# EAGLE design LIC_rack_TS_ext-00 (EAGLE 7.2.0)
AUTHOR: M. Petrilak; VERSION: 00
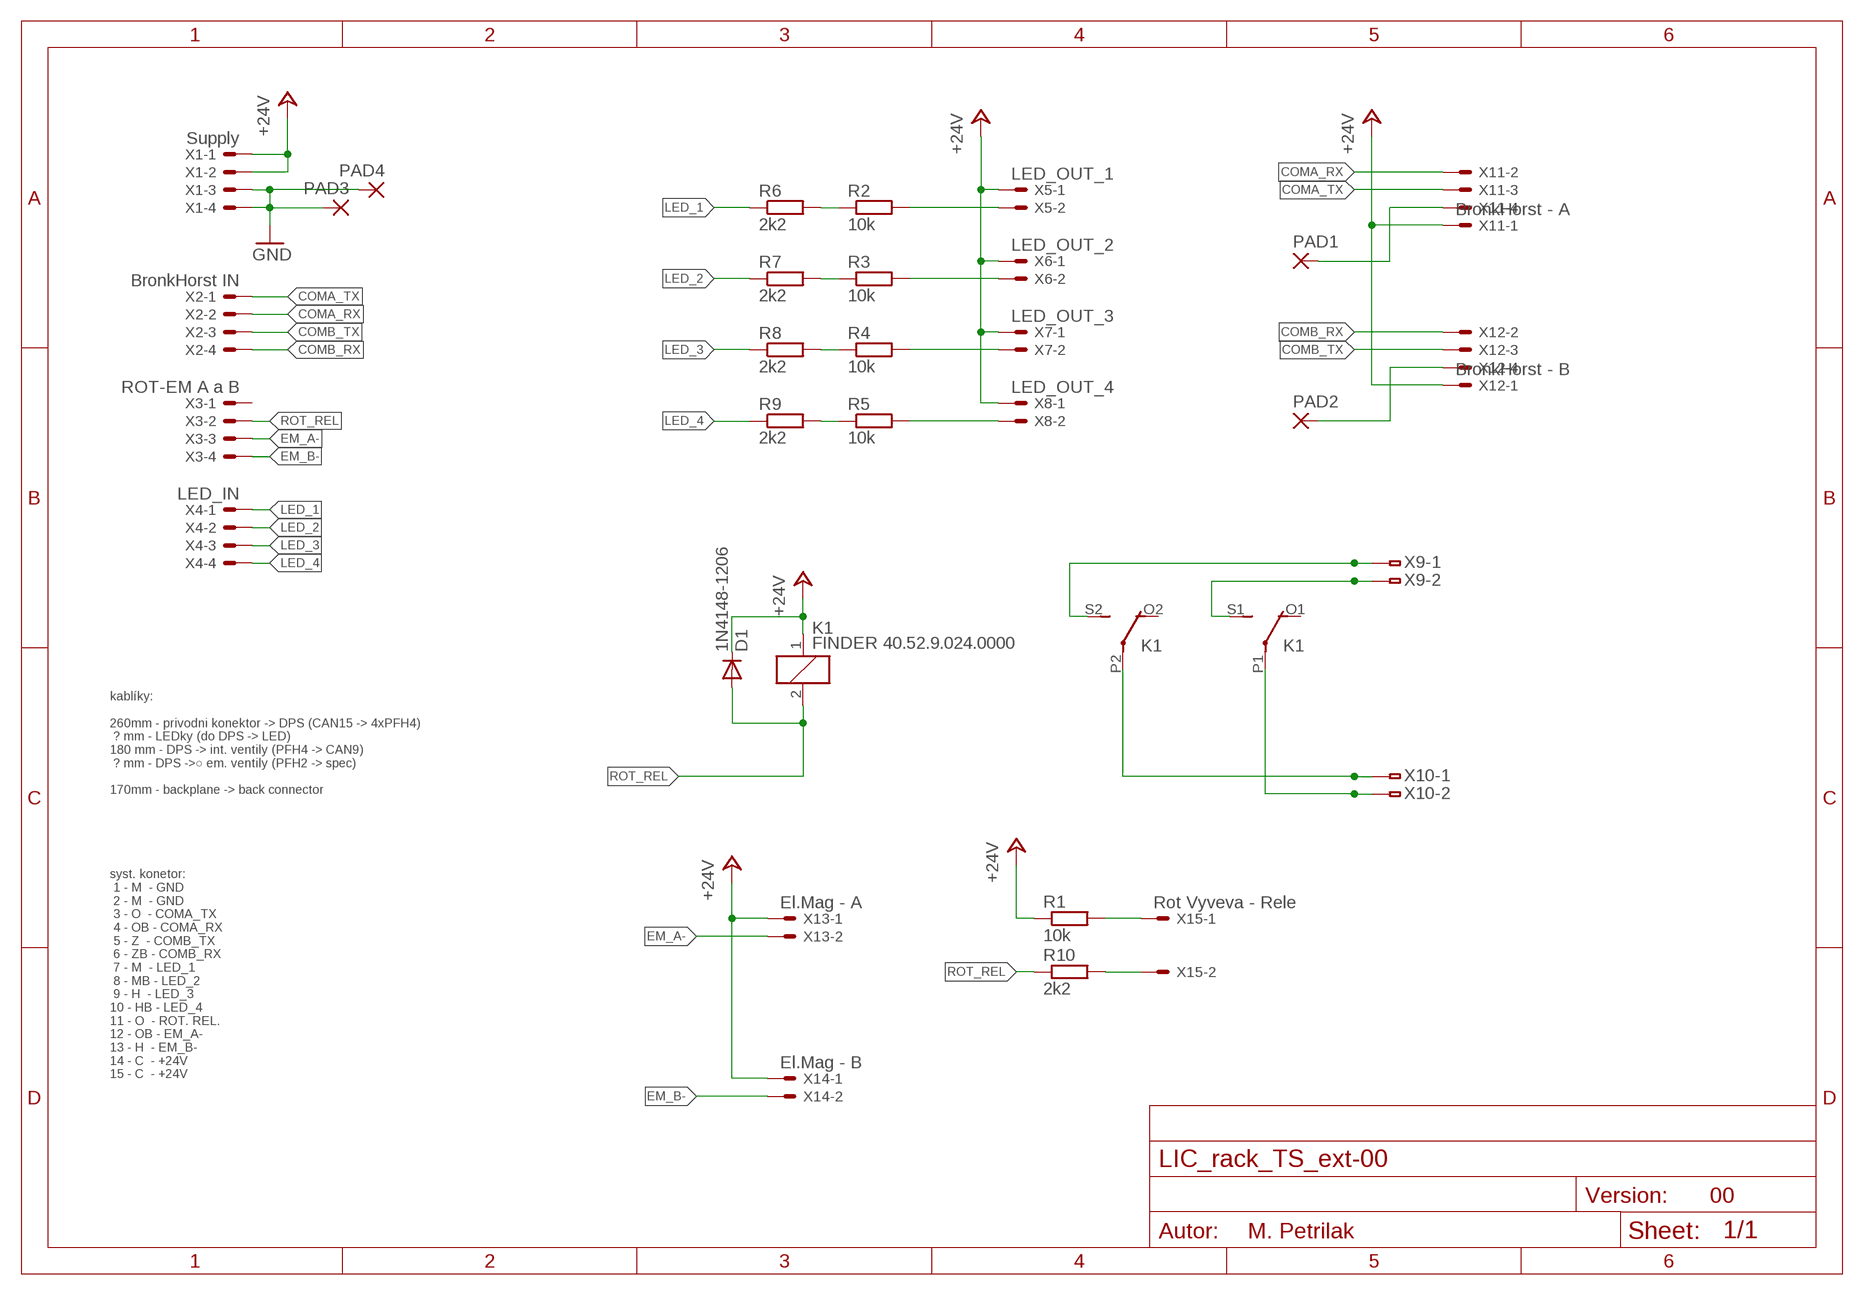
[diagram p0: schematic, sheet 1]

## Parts
D1  1N4148-1206  [R1206]
K1  FINDER 40.52.9.024.0000  4052  [F4052]
PAD1  SMD-2X3  [SMD2-3]
PAD2  SMD-2X3  [SMD2-3]
PAD3  SMD-2X3  [SMD2-3]
PAD4  SMD-2X3  [SMD2-3]
R1  10k  R-EU_R1206  [R1206]
R2  10k  R-EU_R1206  [R1206]
R3  10k  R-EU_R1206  [R1206]
R4  10k  R-EU_R1206  [R1206]
R5  10k  R-EU_R1206  [R1206]
R6  2k2  R-EU_R1206  [R1206]
R7  2k2  R-EU_R1206  [R1206]
R8  2k2  R-EU_R1206  [R1206]
R9  2k2  R-EU_R1206  [R1206]
R10  2k2  R-EU_R1206  [R1206]
X1  Supply  22-23-2041  [22-23-2041]
X2  BronkHorst IN  22-23-2041  [22-23-2041]
X3  ROT-EM A a B  22-23-2041  [22-23-2041]
X4  LED_IN  22-23-2041  [22-23-2041]
X5  LED_OUT_1  22-23-2021  [22-23-2021]
X6  LED_OUT_2  22-23-2021  [22-23-2021]
X7  LED_OUT_3  22-23-2021  [22-23-2021]
X8  LED_OUT_4  22-23-2021  [22-23-2021]
X9  High Voltage Supply - L  WAGO236-401/2  [WAGO236-401_2]
X10  High Voltage Supply - N  WAGO236-401/2  [WAGO236-401_2]
X11  BronkHorst - A  22-23-2041  [22-23-2041]
X12  BronkHorst - B  22-23-2041  [22-23-2041]
X13  El.Mag - A  22-23-2021  [22-23-2021]
X14  El.Mag - B  22-23-2021  [22-23-2021]
X15  Rot Vyveva - Rele  22-23-2021  [22-23-2021]

## Nets
+24V: D1.K(C) K1.1 R1.1 X1.1 X1.2 X5.1 X6.1 X7.1 X8.1 X11.1 X12.1 X13.1 X14.1
COMA_RX: X2.2 X11.2
COMA_TX: X2.1 X11.3
COMB_RX: X2.4 X12.2
COMB_TX: X2.3 X12.3
EM_A-: X3.3 X13.2
EM_B-: X3.4 X14.2
GND: PAD3.1(P) PAD4.1(P) X1.3 X1.4
LED_1: R6.1 X4.1
LED_2: R7.1 X4.2
LED_3: R8.1 X4.3
LED_4: R9.1 X4.4
N$3 [230V]: K1.S1(2:S) X9.2A X9.2B
N$4 [230V]: K1.S2(3:S) X9.1A X9.1B
N$5 [230V]: K1.P1(2:P) X10.2A X10.2B
N$6 [230V]: K1.P2(3:P) X10.1A X10.1B
N$7: R2.2 X5.2
N$8: R3.2 X6.2
N$11: R4.2 X7.2
N$13: R5.2 X8.2
N$14: R2.1 R6.2
N$15: R3.1 R7.2
N$16: R4.1 R8.2
N$17: R5.1 R9.2
N$18: PAD1.1(P) X11.4
N$19: PAD2.1(P) X12.4
N$20: R10.2 X15.2
N$21: R1.2 X15.1
ROT_REL: D1.A K1.2 R10.1 X3.2
Unconnected: K1.O1(2:O) K1.O2(3:O) X3.1

## Notes on the sheet
- kablíky:
  
  260mm - privodni konektor -> DPS (CAN15 -> 4xPFH4)
   ? mm - LEDky (do DPS -> LED) 
  180 mm - DPS -> int. ventily (PFH4 -> CAN9)
   ? mm - DPS ->○ em. ventily (PFH2 -> spec)
  
  170mm - backplane -> back connector
- syst. konetor:
   1 - M  - GND
   2 - M  - GND
   3 - O  - COMA_TX
   4 - OB - COMA_RX
   5 - Z  - COMB_TX
   6 - ZB - COMB_RX
   7 - M  - LED_1
   8 - MB - LED_2
   9 - H  - LED_3
  10 - HB - LED_4
  11 - O  - ROT. REL.
  12 - OB - EM_A-
  13 - H  - EM_B-
  14 - C  - +24V
  15 - C  - +24V

## Library data of the parts
D1 = diode:1N4148: DIODE high speed (Philips)
K1 = relay:4052: RELAY 2 x switch, Finder
PAD1-PAD4 = wirepad:SMD: SMD PAD
R1-R10 = rcl:R-EU_: RESISTOR, European symbol
X1-X4 X11 X12 = con-molex:22-23-2041: .100" (2.54mm) Center Header - 4 Pin
X5-X8 X13-X15 = con-molex:22-23-2021: .100" (2.54mm) Center Header - 2 Pin
X9 X10 = con-malina:WAGO236-401/2: WAGO236-401 Modular Terminal Blocks 0.08-2.5 mm2 Pin Spacing 5 mm Rating: 500V, 16A Color item no. grey 236-401 dark grey 236-742 light grey 236-743 blue 236-744 green 236-745 orange 236-746 light green 236-747 black 236-851

## Net classes
1 230V: clearance 2.7 mm

## Board
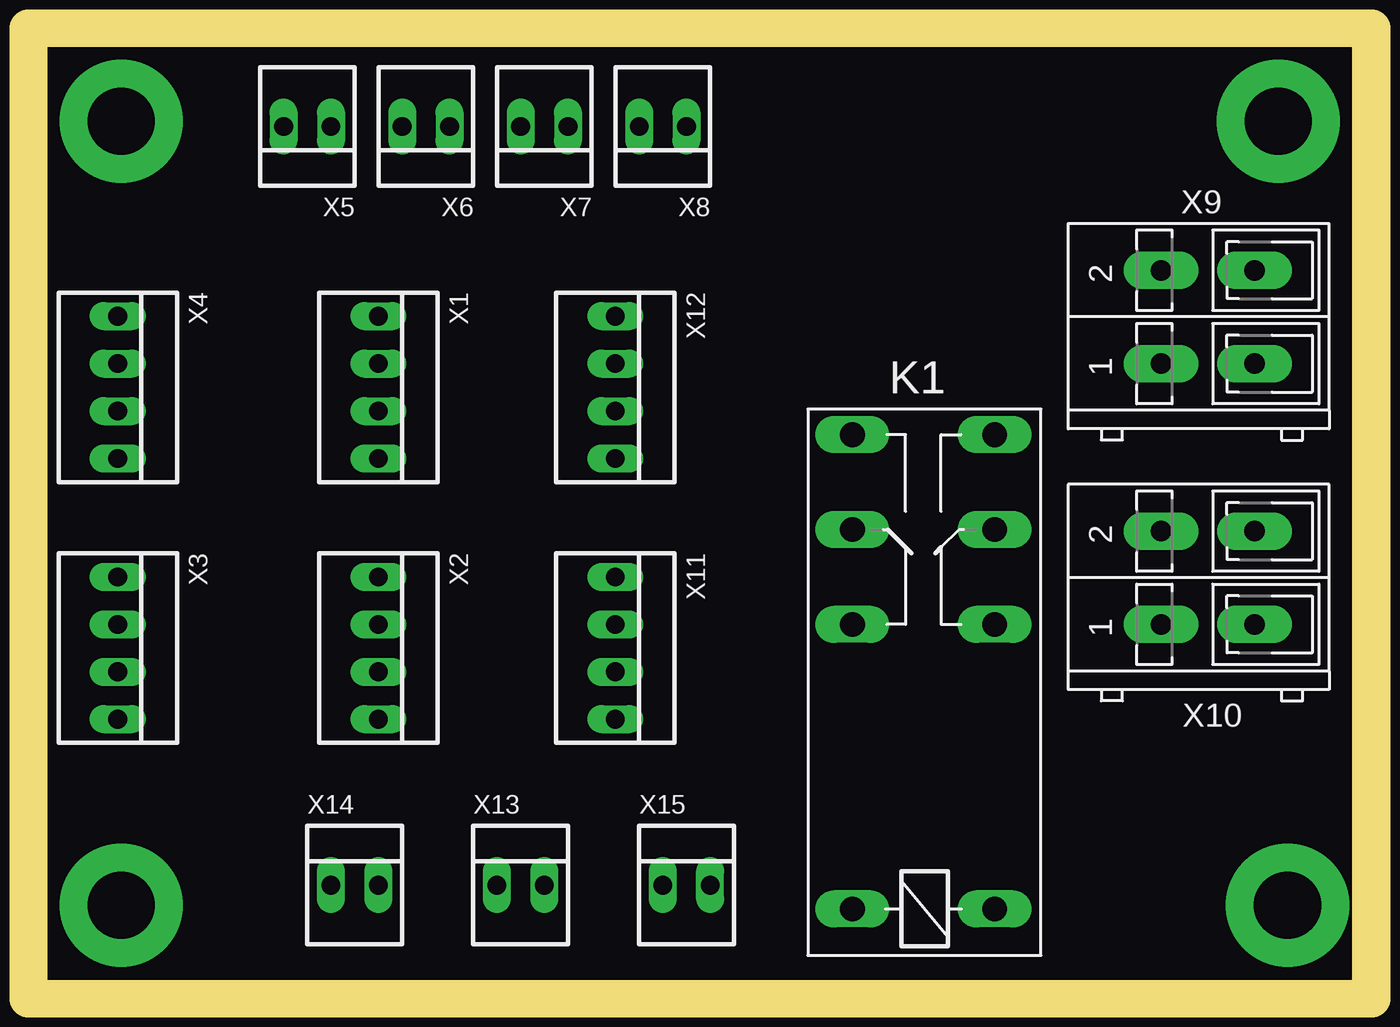
[diagram p1: board, top side]
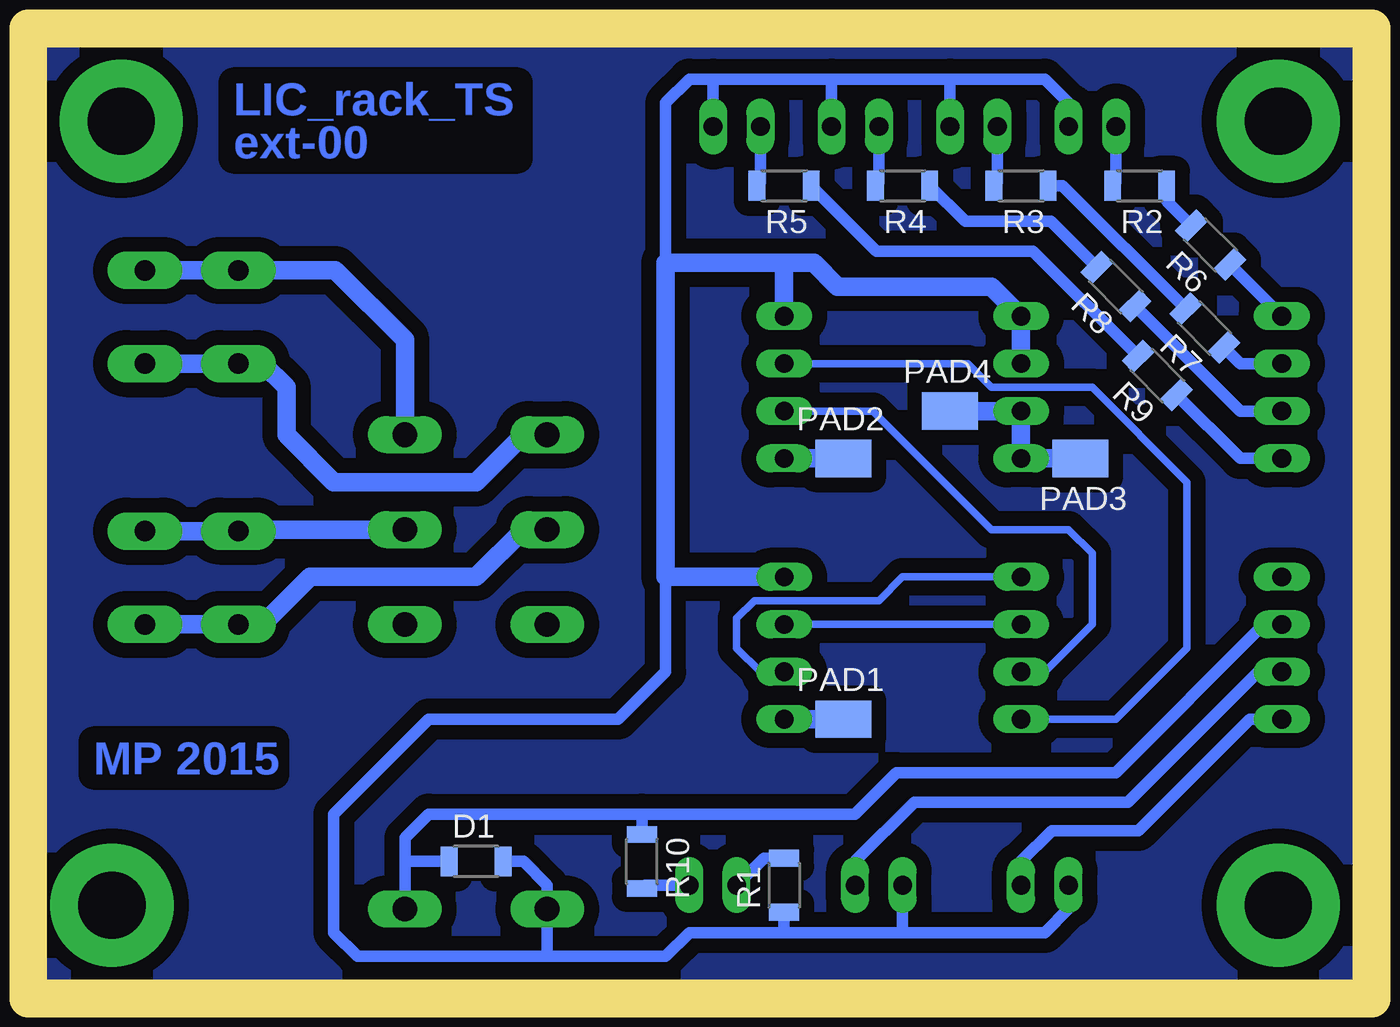
[diagram p2: board, bottom side, seen from below]

Size 70 x 50 mm. Coordinates in mm from the lower left corner, seen from the top.
Outline: 0,0 70,0 70,50 0,50 0,0
Copper layers (1*16): Top 0.035mm / dielectric 1.5mm / Bottom 0.035mm
Design rules "default *": minimum track width 0.3mm, minimum drill 0.6mm, track to track 0.8mm, track to pad 0.8mm, pad to pad 0.5mm, via to via 1mm, smd to smd 8mil, copper to edge 1mil, drill to drill 8mil, minimum pad ring 10mil, minimum via ring 8mil, stop-mask expansion 4mil, vias tented up to drill 0mil, thermal gap 10mil
Milling: 4 lines

### Footprints (pad centres in the part's own frame; a part is rotated, then mirrored left to right if it is on the bottom)
R1206 = smd 0.9 x 1.6: A -1.45,0; K 1.45,0
F4052 = drill 1.321 long: 1 -3.81,3.81; 2 -3.81,-3.81; O1 11.43,-3.81; O2 11.43,3.81; P1 16.51,-3.81; P2 16.51,3.81; S1 21.59,-3.81; S2 21.59,3.81
SMD2-3 = smd 2 x 3: 1 0,0
R1206' = smd 0.9 x 1.6: 1 -1.45,0; 2 1.45,0
22-23-2041 = drill 1 long: 1 -3.81,0; 2 -1.27,0; 3 1.27,0; 4 3.81,0
22-23-2021 = drill 1 long: 1 -1.27,0; 2 1.27,0
WAGO236-401_2 = drill 1.1 pad 2 long: 1A 0,2.5; 1B 0,-2.5; 2A 5,2.5; 2B 5,-2.5

### Placement (x,y rotation side)
D1  46.99,6.35 0 bottom
K1  46.99,7.62 90 top
PAD1  27.3,13.97 270 bottom
PAD2  27.3,27.94 270 bottom
PAD3  14.61,27.94 90 bottom
PAD4  21.59,30.48 270 bottom
R1  10k  [R1206']  30.48,5.08 90 bottom
R2  10k  [R1206']  11.43,42.55 180 bottom
R3  10k  [R1206']  17.78,42.55 180 bottom
R4  10k  [R1206']  24.13,42.55 180 bottom
R5  10k  [R1206']  30.48,42.55 180 bottom
R6  2k2  [R1206']  7.62,39.37 135 bottom
R7  2k2  [R1206']  7.94,34.92 135 bottom
R8  2k2  [R1206']  12.7,37.15 135 bottom
R9  2k2  [R1206']  10.48,32.38 135 bottom
R10  2k2  [R1206']  38.1,6.35 270 bottom
U$2  [A4L-LOC]  -82.3,-75.8 0 top  (outside the outline)
X1  17.78,31.75 270 top
X2  17.78,17.78 270 top
X3  3.81,17.78 270 top
X4  3.81,31.75 270 top
X5  13.97,45.72 180 top
X6  20.32,45.72 180 top
X7  26.67,45.72 180 top
X8  33.02,45.72 180 top
X9  62.23,33.02 90 top
X10  62.23,19.05 90 top
X11  30.48,17.78 270 top
X12  30.48,31.75 270 top
X13  25.4,5.08 0 top
X14  16.51,5.08 0 top
X15  34.29,5.08 0 top

### Tracks (layer width: path | path; a pad name or v marks a point on that pad's centre or on a via)
+24V
  Bottom 0.61: D1.K 44.45,6.35 43.18,5.08 K1.1 43.18,1.27 | 34.29,48.26 35.56,48.26 36.83,46.99 36.83,38.42 | 34.29,48.26 27.94,48.26 | 27.94,48.26 21.59,48.26 | 21.59,48.26 16.51,48.26 15.24,46.99 X5.1 | X6.1 21.59,48.26 | X7.1 27.94,48.26 | 43.18,1.27 53.34,1.27 54.61,2.54 54.61,8.89 49.53,13.97 39.37,13.97 36.83,16.51 36.83,21.59 | 43.18,1.27 36.83,1.27 35.56,2.54 30.48,2.54 | X14.1 15.24,3.81 16.51,2.54 24.13,2.54 | 24.13,2.54 30.48,2.54 | X13.1 24.13,2.54 | X8.1 34.29,48.26 | R1.1 30.48,2.54
  Bottom 1: X1.2 X1.1 19.37,37.15 27.62,37.15 28.89,38.42 30.48,38.42 | 30.48,38.42 36.83,38.42 36.83,21.59 X11.1 | X12.1 30.48,38.42
COMA_RX
  Bottom 0.406: X11.2 X2.2
COMA_TX
  Bottom 0.406: X2.1 24.13,21.59 25.4,20.32 32.07,20.32 33.02,19.37 33.02,17.78 31.75,16.51 X11.3
COMB_RX
  Bottom 0.406: X2.4 12.7,13.97 8.89,17.78 8.89,26.67 13.97,31.75 19.37,31.75 20.64,33.02 X12.2
COMB_TX
  Bottom 0.406: X2.3 16.51,16.51 13.97,19.05 13.97,22.86 15.24,24.13 19.37,24.13 25.72,30.48 X12.3
EM_A-
  Bottom 0.61: X13.2 26.67,6.35 23.5,9.53 12.06,9.53 5.08,16.51 X3.3
EM_B-
  Bottom 0.61: X3.4 5.53,13.97 11.5,8 16.13,8 17.78,6.35 X14.2
GND
  Bottom 1: PAD3.1 X1.4 X1.3 PAD4.1
LED_1
  Bottom 0.61: X4.1 | X4.1 R6.1
LED_2
  Bottom 0.61: X4.2 6.03,33.02 R7.1
LED_3
  Bottom 0.61: X4.3 6.03,30.48 R8.1
LED_4
  Bottom 0.61: X4.4 6.03,27.94 R9.1
N$1  (via drill 3.6 pad 6.6)
  other vias: 4,4
N$2  (via drill 3.6 pad 6.6)
  other vias: 4,46
N$3
  Bottom 1: X9.2B X9.2A 54.53,38.02 50.8,34.29 K1.S1
N$4
  Bottom 1: X9.1B X9.1A 58.42,33.02 57.15,31.75 57.15,29.21 54.61,26.67 46.99,26.67 44.45,29.21 K1.S2
N$5
  Bottom 1: X10.2B X10.2A 59.65,24.13 K1.P1
N$6
  Bottom 1: X10.1B X10.1A 58.42,19.05 55.88,21.59 46.99,21.59 44.45,24.13 K1.P2
N$7
  Bottom 0.61: X5.2 12.7,42.73 R2.2
N$8
  Bottom 0.61: X6.2 19.05,42.73 R3.2
N$9  (via drill 3.6 pad 6.6)
  other vias: 66,46
N$10  (via drill 3.6 pad 6.6)
  other vias: 66.5,4
N$11
  Bottom 0.61: X7.2 25.4,42.73 R4.2
N$12
  pour Bottom: 0,0 70,0 70,50 0,50
N$13
  Bottom 0.61: X8.2 31.75,42.73 R5.2
N$14
  Bottom 0.61: R6.2 9.98,41.73 R2.1
N$15
  Bottom 0.61: R7.2 15.56,42.55 R3.1
N$16
  Bottom 0.61: R8.2 16.19,40.64 20.77,40.64 R4.1
N$17
  Bottom 0.61: R9.2 17.14,39.05 25.54,39.05 R5.1
N$18
  Bottom 1: PAD1.1 X11.4
N$19
  Bottom 1: PAD2.1 X12.4
N$20
  Bottom 0.61: X15.2 37.92,5.08 R10.2
N$21
  Bottom 0.61: R1.2 31.57,6.53 X15.1
ROT_REL
  Bottom 0.61: K1.2 50.8,6.35 | 50.8,6.35 50.8,7.62 49.53,8.89 38.1,8.89 | D1.A 50.8,6.35 | 38.1,8.89 26.67,8.89 24.45,11.11 12.7,11.11 4.76,19.05 X3.2 | R10.1 38.1,8.89

### Text on the board
Bottom: LIC_rack_TS / ext-00 | MP 2015
Document: Top view | 00